# EAGLE design Group 13 Layout and sch v2 (EAGLE 9.2.0)
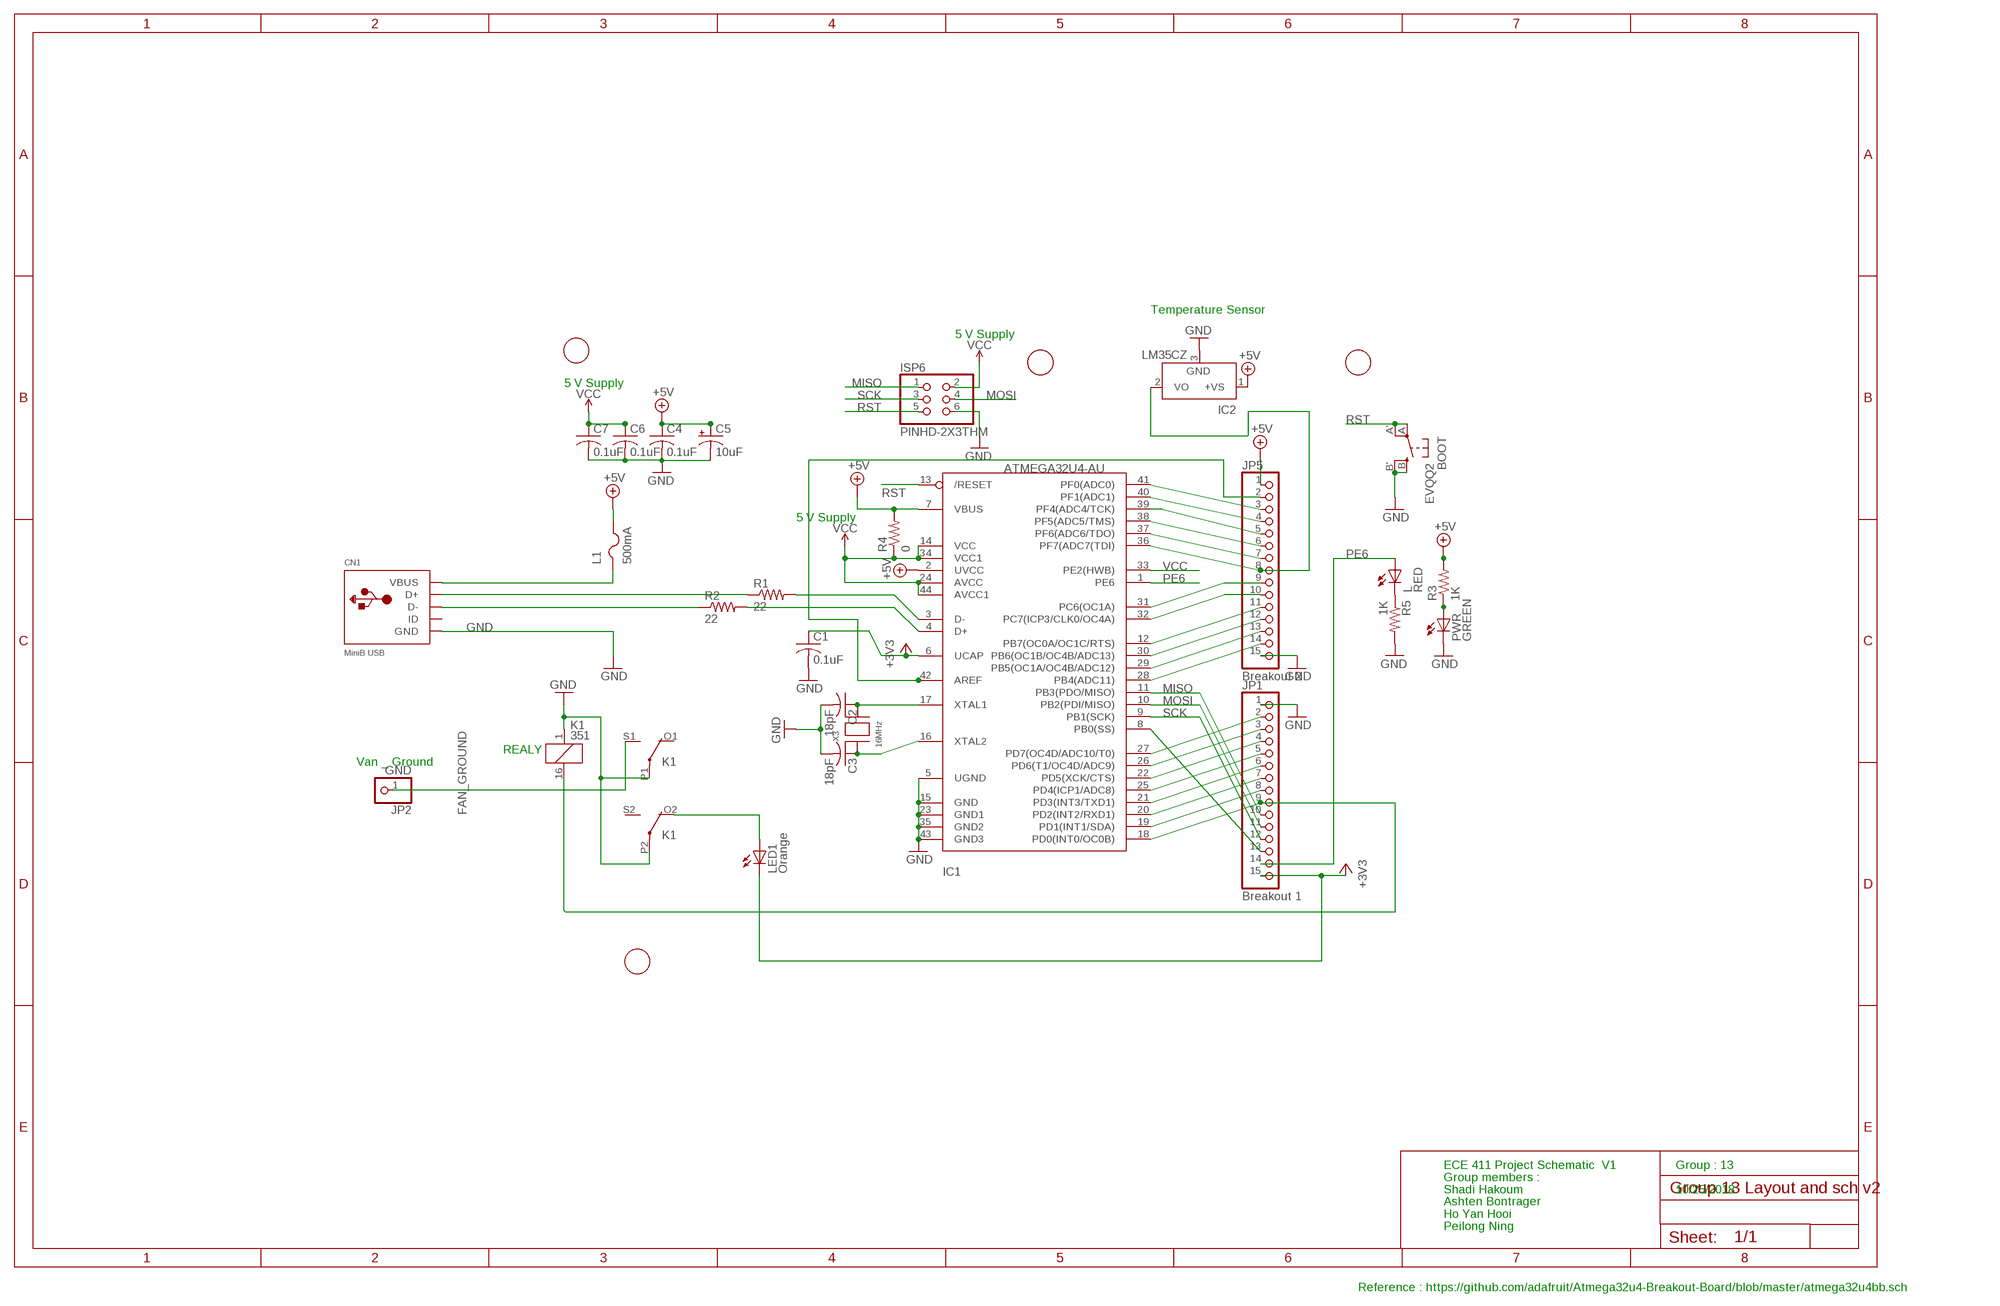
[diagram p0: schematic, sheet 1]

## Parts
BOOT  EVQQ2  [EVQ-Q2]
C1  0.1uF  C-USC0805K  [C0805K]
C2  18pF  C-USC0805K  [C0805K]
C3  18pF  C-USC0805K  [C0805K]
C4  0.1uF  C-USC0805K  [C0805K]
C5  10uF  CPOL-USA/3216-18R  [A/3216-18R]
C6  0.1uF  C-USC0805K  [C0805K]
C7  0.1uF  C-USC0805K  [C0805K]
CN1  MiniB USB  USBMINIB  [USB-MINIB]
IC1  ATMEGA32U4-AU  [TQFP44]
IC2  LM35CZ  [TO92]
ISP6  PINHD-2X3THM  [ISP6]
JP1  Breakout 1  PINHD-1X15-CB  [1X15-CB]
JP2  GND  PINHD-1X1  [1X01]
JP5  Breakout 2  PINHD-1X15-CB  [1X15-CB]
K1  351  [351]
L  RED  LEDCHIPLED_0805  [CHIPLED_0805]
L1  500mA  PTCFUSE-1206  [R1206]
LED1  Orange  LED3MM  [LED3MM]
PWR  GREEN  LEDCHIPLED_0805  [CHIPLED_0805]
R1  22  R-US_R0805  [R0805]
R2  22  R-US_R0805  [R0805]
R3  1K  R-US_R0805  [R0805]
R4  0  R-US_M1206  [M1206]
R5  1K  R-US_R0805  [R0805]
U$1  FIDUCIAL  [FIDUCIAL_1MM]
U$2  FIDUCIAL  [FIDUCIAL_1MM]
U$3  FIDUCIAL  [FIDUCIAL_1MM]
U$6  FIDUCIAL  [FIDUCIAL_1MM]
X3  16MHz  XTALNX5032  [NX5032]

## Nets
+3V3: C1.1 IC1.6(UCAP) JP1.15 LED1.K(C)
+5V: C4.1 C5.+ IC1.2(UVCC) IC1.7(VBUS) IC2.1(+VS) JP5.1 L1.2 R3.2 R4.2
FAN_GROUND: JP2.1 K1.S1(2:S)
GND: BOOT.B'(S1) BOOT.B(S) C1.2 C2.2 C3.2 C4.2 C5.- C6.2 C7.2 CN1.GND IC1.5(UGND) IC1.15(GND) IC1.23(GND1) IC1.35(GND2) IC1.43(GND3) IC2.3(GND) ISP6.6 JP1.1 JP5.15 K1.1 K1.P1(2:P) K1.P2(3:P) PWR.C R5.2
MISO: IC1.11(PB3(PDO/MISO)) ISP6.1 JP1.10
MOSI: IC1.10(PB2(PDI/MISO)) ISP6.4 JP1.11
N$1: PWR.A R3.1
N$2: CN1.D- R2.1
N$3: IC1.3(D-) R1.2
N$4: IC1.4(D+) R2.2
N$5: CN1.D+ R1.1
N$6: IC1.42(AREF) JP5.2
N$7: IC1.37(PF6(ADC6/TDO)) JP5.7
N$8: C2.1 IC1.17(XTAL1) X3.P$2
N$9: C3.1 IC1.16(XTAL2) X3.P$1
N$10: L.C R5.1
N$12: K1.O2(3:O) LED1.A
N$13: IC1.31(PC6(OC1A)) JP5.9
N$14: IC1.32(PC7(ICP3/CLK0/OC4A)) JP5.10
PB0: IC1.8(PB0(SS)) JP1.13
PB4: IC1.28(PB4(ADC11)) JP5.14
PB5: IC1.29(PB5(OC1A/OC4B/ADC12)) JP5.13
PB6: IC1.30(PB6(OC1B/OC4B/ADC13)) JP5.12
PB7: IC1.12(PB7(OC0A/OC1C/RTS)) JP5.11
PD0: IC1.18(PD0(INT0/OC0B)) JP1.9 K1.16
PD1: IC1.19(PD1(INT1/SDA)) JP1.8
PD2: IC1.20(PD2(INT2/RXD1)) JP1.7
PD3: IC1.21(PD3(INT3/TXD1)) JP1.6
PD4: IC1.25(PD4(ICP1/ADC8)) JP1.5
PD5: IC1.22(PD5(XCK/CTS)) JP1.4
PD6: IC1.26(PD6(T1/OC4D/ADC9)) JP1.3
PD7: IC1.27(PD7(OC4D/ADC10/T0)) JP1.2
PE6: IC1.1(PE6) JP1.14 L.A
PF0: IC1.41(PF0(ADC0)) JP5.3
PF1: IC1.40(PF1(ADC1)) JP5.4
PF4: IC1.39(PF4(ADC4/TCK)) JP5.5
PF5: IC1.38(PF5(ADC5/TMS)) JP5.6
PF7: IC1.36(PF7(ADC7(TDI)) IC2.2(VO) JP5.8
RST: BOOT.A'(P1) BOOT.A(P) IC1.13(/RESET) ISP6.5
SCK: IC1.9(PB1(SCK)) ISP6.3 JP1.12
VBUS: CN1.VBUS L1.1
VCC: C6.1 C7.1 IC1.14(VCC) IC1.24(AVCC) IC1.33(PE2(HWB)) IC1.34(VCC1) IC1.44(AVCC1) ISP6.2 R4.1
Unconnected: CN1.ID K1.O1(2:O) K1.S2(3:S)

## Notes on the sheet
- Temperature Sensor
- 5 V Supply
- 5 V Supply
- 5 V Supply
- REALY
- Van _ Ground
- ECE 411 Project Schematic  V1 | Group : 13
- Group members :
- Shadi Hakoum | 10/25/2018
- Ashten Bontrager
- Ho Yan Hooi
- Peilong Ning
- Reference : https://github.com/adafruit/Atmega32u4-Breakout-Board/blob/master/atmega32u4bb.sch

## Library data of the parts
BOOT = adaprog:EVQQ2
C1-C4 C6 C7 = adafruit:C-US: CAPACITOR, American symbol
C5 = adafruit:CPOL-US: POLARIZED CAPACITOR, American symbol
CN1 = adafruit:USB: USB Connectors USBMINIB - Surface Mount Female Mini-B USB Connector 4UConnector: 06564 By microbuilder.eu Thru-hole RA Female Mini-B USB Connector 4UConnector: 18732 By ladyada.net
IC1 = adaprog:ATMEGA32U4
IC2 = lm35:LM35: Single-Supply Centigrade Temperature Sensor Vout = (10mV/°C x Temp °C) +5mmmV Source: http://www.national.com/ds/LM/LM35.pdf
ISP6 = adaprog:PINHD-2X3
JP1 JP5 = adafruit:PINHD-1X15: PIN HEADER
JP2 = adafruit:PINHD-1X1: Pin header 1x1 for 0.1" spacing With round pins
K1 = relay:351: RELAY 2 x switch, Omron; OC_FARNELL: unknown; OC_NEWARK: unknown
L LED1 PWR = adafruit:LED: LED OSRAM: - CHIPLED LG R971, LG N971, LY N971, LG Q971, LY Q971, LO R971, LY R971 LH N974, LH R974 LS Q976, LO Q976, LY Q976 LO Q996 - Hyper CHIPLED LW Q18S LB Q993, LB Q99A, LB R99A - SideLED LS A670, LO A670, LY A670, LG A670, LP A670 LB A673, LV A673, LT A673, LW A673 LH A674 LY A675 LS A676, LA A676, LO A676, LY A676, LW A676 LS A679, LY A679, LG A679 - Hyper Micro SIDELED® LS Y876, LA Y876, LO Y876, LY Y876 LT Y87S - SmartLED LW L88C, LW L88S LB L89C, LB L89S, LG L890 LS L89K, LO L89K, LY L89K LS L896, LA L896, LO L896, LY L896 - TOPLED LS T670, LO T670, LY T670, LG T670, LP T670 LSG T670, LSP T670, LSY T670, LOP T670, LYG T670 LG T671, LOG T671, LSG T671 LB T673, LV T673, LT T673, LW T673 LH T674 LS T676, LA T676, LO T676, LY T676, LB T676, LH T676, LSB T676, LW T676 LB T67C, LV T67C, LT T67C, LS T67K, LO T67K, LY T67K, LW E67C LS E67B, LA E67B, LO E67B, LY E67B, LB E67C, LV E67C, LT E67C LW T67C LS T679, LY T679, LG T679 LS T770, LO T770, LY T770, LG T770, LP T770 LB T773, LV T773, LT T773, LW T773 LH T774 LS E675, LA E675, LY E675, LS T675 LS T776, LA T776, LO T776, LY T776, LB T776 LHGB T686 LT T68C, LB T68C - Hyper Mini TOPLED® LB M676 - Mini TOPLED Santana® LG M470 LS M47K, LO M47K, LY M47K Source: http://www.osram.convergy.de/
L1 = adafruit:PTCFUSE: PTC fuses, resettable thermistors
R1-R3 R5 = adafruit:R-US_: RESISTOR, American symbol
R4 = rcl:R-US_: RESISTOR, American symbol; SPICEPREFIX: R
U$1-U$3 U$6 = adafruit:FIDUCIAL: For use by pick and place machines to calibrate the vision/machine, 1mm By microbuilder.eu
X3 = adaprog:XTAL

## Board
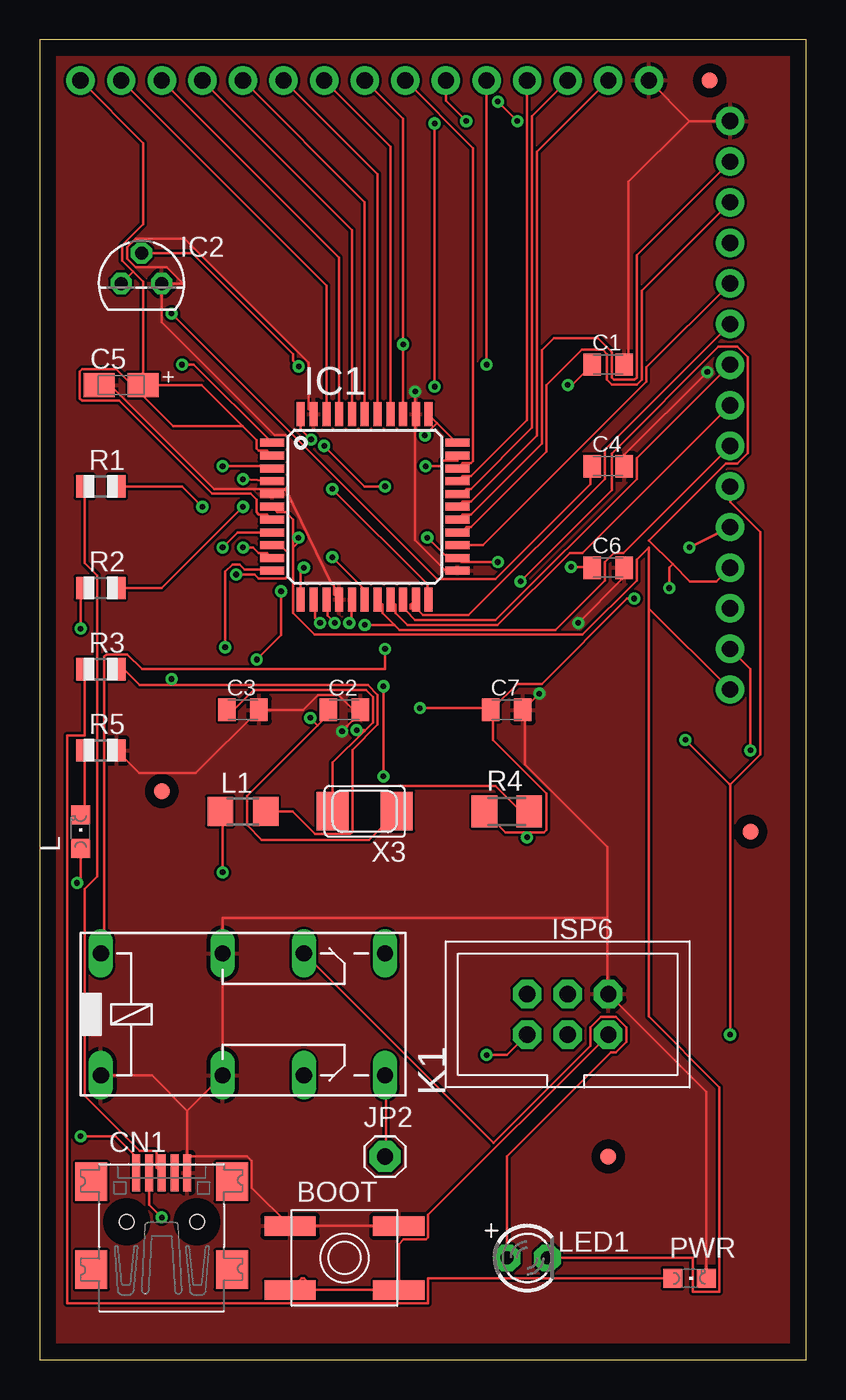
[diagram p1: board, top side]
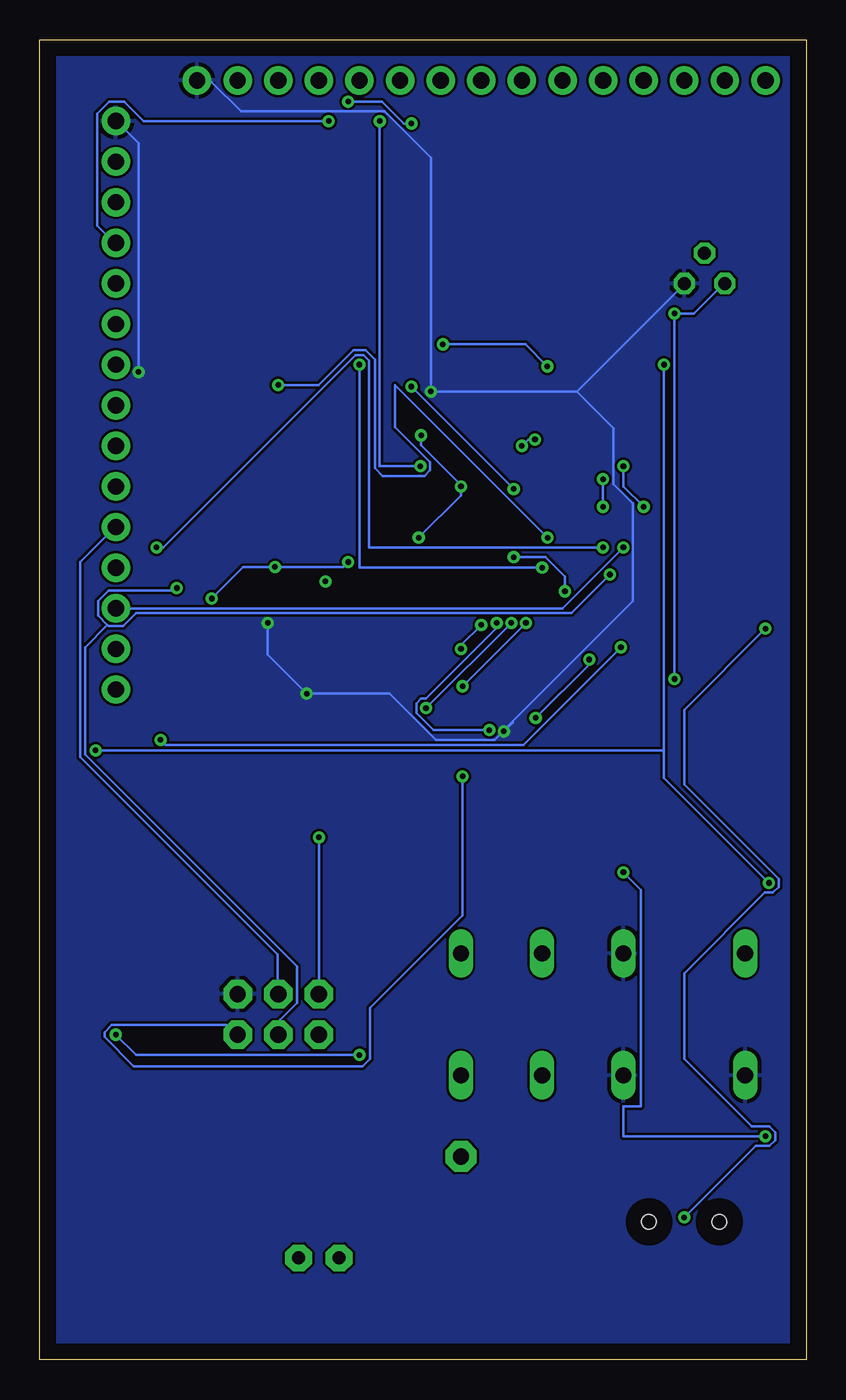
[diagram p2: board, bottom side, seen from below]

Size 47.93 x 82.54 mm. Coordinates in mm from the lower left corner, seen from the top.
Outline: 0,0 47.93,0 47.93,82.54 0,82.54 0,0
Copper layers (1*16): Top 0.035mm / dielectric 1.5mm / Bottom 0.035mm
Design rules "default": minimum track width 6mil, minimum drill 0.35mm, track to track 6mil, track to pad 6mil, pad to pad 6mil, via to via 6mil, smd to smd 6mil, copper to edge 40mil, drill to drill 6mil, minimum pad ring 10mil, minimum via ring 8mil, stop-mask expansion 4mil, vias tented up to drill 0mil, thermal gap 10mil

### Footprints (pad centres in the part's own frame; a part is rotated, then mirrored left to right if it is on the bottom)
EVQ-Q2 = smd 3.2 x 1.2: A -3.4,-2; A' 3.4,-2; B -3.4,2; B' 3.4,2
C0805K = smd 1.1 x 1.4: 1 -1,0; 2 1,0
A/3216-18R = smd 1.95 x 1.5: + 1.375,0; - -1.375,0
USB-MINIB = smd 0.5 x 2.308: D+ 0,4.064; D- -0.8,4.064; GND 1.6,4.064; ID 0.8,4.064; VBUS -1.6,4.064 | smd 2 x 2.4: GND1 -4.4,-2; GND2 -4.4,3.5; GND3 4.4,3.5; GND4 4.4,-2 | hole 0.9: -2.2,1; 2.2,1
TQFP44 = smd 1.5 x 0.5: 1 -5.8,4; 2 -5.8,3.2; 3 -5.8,2.4; 4 -5.8,1.6; 5 -5.8,0.8; 6 -5.8,0; 7 -5.8,-0.8; 8 -5.8,-1.6; 9 -5.8,-2.4; 10 -5.8,-3.2; 11 -5.8,-4; 23 5.8,-4; 24 5.8,-3.2; 25 5.8,-2.4; 26 5.8,-1.6; 27 5.8,-0.8; 28 5.8,0; 29 5.8,0.8; 30 5.8,1.6; 31 5.8,2.4; 32 5.8,3.2; 33 5.8,4 | smd 0.5 x 1.5: 12 -4,-5.8; 13 -3.2,-5.8; 14 -2.4,-5.8; 15 -1.6,-5.8; 16 -0.8,-5.8; 17 0,-5.8; 18 0.8,-5.8; 19 1.6,-5.8; 20 2.4,-5.8; 21 3.2,-5.8; 22 4,-5.8; 34 4,5.8; 35 3.2,5.8; 36 2.4,5.8; 37 1.6,5.8; 38 0.8,5.8; 39 0,5.8; 40 -0.8,5.8; 41 -1.6,5.8; 42 -2.4,5.8; 43 -3.2,5.8; 44 -4,5.8
TO92 = drill 0.813 octagon: 1 -1.27,0; 2 0,1.905; 3 1.27,0
ISP6 = drill 1.016 pad 1.778 octagon: 1 -2.54,-1.27; 2 -2.54,1.27; 3 0,-1.27; 4 0,1.27; 5 2.54,-1.27; 6 2.54,1.27
1X15-CB = drill 1.016 pad 1.778: 1 -17.78,0; 2 -15.24,0; 3 -12.7,0; 4 -10.16,0; 5 -7.62,0; 6 -5.08,0; 7 -2.54,0; 8 0,0; 9 2.54,0; 10 5.08,0; 11 7.62,0; 12 10.16,0; 13 12.7,0; 14 15.24,0; 15 17.78,0
1X01 = drill 1.016 pad 1.93 octagon: 1 0,0
351 = drill 1.016 long: 1 -3.81,-3.81; 16 -3.81,3.81; O1 8.89,-3.81; O2 8.89,3.81; P1 3.81,-3.81; P2 3.81,3.81; S1 13.97,-3.81; S2 13.97,3.81
CHIPLED_0805 = smd 1.2 x 1.2: A 0,-1.05; C 0,1.05
R1206 = smd 1.6 x 1.803: 1 -1.422,0; 2 1.422,0
LED3MM = drill 0.813 pad 1.676 octagon: A -1.27,0; K 1.27,0
R0805 = smd 1.1 x 1.4: 1 -1,0; 2 1,0
M1206 = smd 1.6 x 2: 1 -1.4,0; 2 1.4,0
FIDUCIAL_1MM = smd 1 x 1: 1 0,0
NX5032 = smd 2 x 2.4: P$1 2,0; P$2 -2,0

### Placement (x,y rotation side)
BOOT  19.05,6.35 0 top
C1  35.56,62.23 0 top
C2  19.05,40.64 0 top
C3  12.7,40.64 0 top
C4  35.56,55.88 0 top
C5  5.08,60.96 0 top
C6  35.56,49.53 0 top
C7  29.21,40.64 0 top
CN1  7.62,7.62 0 top
IC1  20.32,53.34 0 top
IC2  6.35,67.31 0 top
ISP6  33.02,21.59 0 top
JP1  43.18,59.69 270 top
JP2  21.59,12.7 0 top
JP5  20.32,80.01 0 top
K1  7.62,21.59 0 top
L  2.54,33.02 0 top
L1  12.7,34.29 0 top
LED1  30.48,6.35 0 top
PWR  40.64,5.08 270 top
R1  3.81,54.61 0 top
R2  3.81,48.26 0 top
R3  3.81,43.18 0 top
R4  29.21,34.29 0 top
R5  3.81,38.1 0 top
U$1  44.45,33.02 0 top
U$2  41.91,80.01 0 top
U$3  35.56,12.7 0 top
U$6  7.62,35.56 0 top
X3  20.32,34.29 180 top

### Tracks (layer width: path | path; a pad name or v marks a point on that pad's centre or on a via)
+3V3  (via drill 0.35)
  Top 0.152: 38.1,46.99 38.1,21.45 42.52,17.04 42.52,4.25 40.86,4.25 40.86,6.35 LED1.K | 38.1,46.99 38.1,50.8 37.34,50.04 37.34,48.74 33.95,45.34 17.2,45.34 15.84,46.7 15.84,50.8 | 38.1,46.99 JP1.15 | IC1.6 14.84,53.02 15.37,53.02 15.84,52.54 15.84,50.8 | C1.1 33.29,60.96 v33.02,60.96 | v16.17,51.41 16.17,51.13 15.84,50.8
  Bottom 0.152: v16.17,51.41 25.72,60.96 25.72,58.33 23.52,56.13 23.52,55.63 23.88,55.27 26.49,55.27 26.98,55.75 26.98,62.55 27.56,63.14 28.32,63.14 30.5,60.96 v33.02,60.96
+5V  (via drill 0.35)
  Top 0.152: 12.67,58.39 10.1,60.96 C5.+ 6.46,67.42 5.82,68.05 | 12.67,58.39 13.54,57.52 13.54,57 13.68,56.86 14.2,56.86 IC1.2 | JP5.1 6.46,76.09 6.46,71.01 5.16,69.71 5.16,68.72 5.82,68.05 | R3.2 5.23,43.18 6.23,42.18 8.23,42.18 | 19.55,35.87 19.55,33 19.41,32.86 17.23,32.86 15.8,34.29 L1.2 | 19.55,35.87 19.55,38.13 21.13,39.72 21.13,41.56 20.52,42.18 8.23,42.18 | IC1.7 14.2,52.86 13.68,52.86 13.54,53 13.54,53.8 13.18,54.16 10.78,54.16 4.95,59.98 2.63,59.98 2.5,60.12 2.5,61.8 2.63,61.94 4.78,61.94 8.32,58.39 12.67,58.39 | 19.55,35.87 28.5,35.87 30.02,34.34 30.48,34.34 R4.2 | v8.23,65.43 24.84,48.82 28.5,48.82 34.44,54.76 34.44,55.83 C4.1 | v8.23,42.57 8.23,42.18 | IC2.1 5.82,68.05
  Bottom 0.152: IC2.1 5.18,67.26 7.01,65.43 v8.23,65.43 v8.23,42.57
FAN_GROUND
  Top 0.152: K1.S1 21.64,17.73 21.64,12.7 JP2.1
GND  (via drill 0.35)
  Top 0.152: JP5.15 40.64,77.47 | 40.64,77.47 JP1.1 | 40.64,77.47 36.83,73.66 36.83,62.23 C1.2 | IC1.43 16.8,59.46 16.8,62.37 9.07,70.1 5.98,70.1 5.46,69.58 5.46,68.85 5.98,68.33 7.93,68.33 8.95,67.31 IC2.3 7.62,64.88 14.68,57.82 15.37,57.82 15.5,57.69 15.5,54.6 15.37,54.46 | C5.- 4.41,60.96 10.9,54.46 15.37,54.46 | CN1.GND 9.22,12.7 | 9.22,12.7 9.22,15.57 | 9.22,15.57 K1.P1 K1.P2 11.43,27.63 35.51,27.63 | 9.22,12.7 12.96,12.7 13.25,12.41 13.25,10.75 BOOT.B BOOT.B' | PWR.C 41.69,16.73 ISP6.6 35.51,22.91 35.51,27.63 | 9.22,15.57 7.01,17.78 K1.1 | R5.2 6.21,36.7 7.47,36.7 7.48,36.7 7.76,36.7 7.77,36.7 9.76,36.7 C3.2 16.48,40.64 17.41,41.57 18.7,41.57 19.62,40.64 | 19.62,40.64 C2.2 | 15.37,54.46 IC1.5 | 15.37,54.46 18.25,48.52 18.27,48.52 18.4,48.39 18.4,47.86 IC1.15 | 35.51,27.63 35.51,32.05 30.33,37.24 30.33,40.59 C7.2 30.33,40.74 v31.24,41.66 | v33.68,46.08 36.42,48.82 36.42,49.43 C6.2 | v41.76,61.77 36.58,56.59 36.58,55.98 C4.2 | IC1.23 26.06,49.43 25.3,49.43 23.47,51.26 23.47,59.03 IC1.35 23.47,59.18 v23.47,60.55 | 19.62,40.64 19.62,40.01 19.59,39.98 19.56,39.98 19.2,39.62 19.2,39.6 v18.9,39.29
  Bottom 0.152: v33.68,46.08 33.68,44.09 v31.24,41.66 26.06,41.66 23.16,38.76 19.51,38.76 18.34,39.93 | v41.76,61.77 41.76,76.1 43.13,77.47 JP1.1 | 14.33,60.55 v23.47,60.55 23.47,75.18 26.36,78.08 35.36,78.08 37.19,79.91 38.1,79.91 JP5.15 | 14.33,60.55 7.62,67.26 IC2.3 | 18.34,39.93 10.82,47.45 10.82,53.54 12.04,54.76 12.04,58.27 14.33,60.55 | v18.9,39.29 18.34,39.86 18.34,39.93
  pour Top: -1.27,83.82 -1.27,-1.27 49.53,-1.27 49.53,83.82
  pour Bottom: -2.54,85.09 50.8,85.09 50.8,-2.54 -2.54,-2.54
MISO  (via drill 0.35)
  Top 0.152: JP1.10 43.18,53.65 45.06,51.77 45.06,37.85 43.18,35.97 | 43.18,35.97 v43.18,20.32 | v27.94,19.05 29.21,19.05 ISP6.1 | v11.58,44.55 11.58,49.28 12.04,49.73 12.5,49.73 12.8,49.43 14.48,49.43 IC1.11 | v40.39,38.76 43.13,36.02 43.18,35.97
  Bottom 0.152: v43.18,20.32 41.91,19.05 v27.94,19.05 | v11.58,44.55 17.68,38.46 40.08,38.46 v40.39,38.76
MOSI  (via drill 0.35)
  Top 0.152: JP1.11 v40.64,50.8 | IC1.10 14.2,50.46 13.68,50.46 13.34,50.8 v12.7,50.8
  Bottom 0.152: v40.64,50.8 40.23,50.8 28.19,62.84 27.69,62.84 27.33,62.48 27.33,50.8 v12.7,50.8 | ISP6.4 33.07,22.91 33.07,25.35 45.41,37.69 45.41,49.89 43.28,52.02 JP1.11
N$1
  Top 0.152: PWR.A 24.28,5.08 24.28,3.52 1.71,3.52 1.71,39.03 2.81,39.03 R3.1
N$2  (via drill 0.35)
  Top 0.152: CN1.D- 6.82,9.69 v7.62,8.89 | v2.54,45.72 2.54,47.99 R2.1
  Bottom 0.152: v2.54,45.72 7.62,40.64 7.62,35.97 1.71,30.06 1.71,29.56 2.07,29.21 2.57,29.21 7.62,24.16 7.62,18.8 3.4,14.58 2.29,14.58 1.93,14.22 1.93,13.72 2.29,13.36 3.15,13.36 v7.62,8.89
N$3  (via drill 0.35)
  Top 0.152: R1.2 8.89,54.61 v10.16,53.34 | v11.43,55.88 14.38,55.88 IC1.3
  Bottom 0.152: v10.16,53.34 11.43,54.61 v11.43,55.88
N$4  (via drill 0.35)
  Top 0.152: R2.2 7.62,48.26 v12.7,53.34 | v12.7,55.07 IC1.4
  Bottom 0.152: v12.7,53.34 v12.7,55.07
N$5
  Top 0.152: CN1.D+ 7.3,12 7.3,12.93 7.17,13.07 6.24,13.07 2.81,16.49 2.81,29.45 3.59,30.22 3.59,49.05 2.81,49.83 R1.1
N$6
  Top 0.152: JP5.2 17.92,67.17 IC1.42
N$7
  Top 0.152: JP5.7 21.92,75.87 IC1.37
N$8  (via drill 0.35)
  Top 0.152: 17.37,39.68 12.95,35.26 12.95,33.43 13.87,32.51 20.57,32.51 22.25,34.19 X3.P$2 | 17.37,39.68 17.98,40.28 17.98,40.59 C2.1 | v18.29,50.19 20.27,48.21 20.27,47.6 IC1.17 | v15.09,48.06 15.09,45.31 v13.56,43.79 | 17.37,39.68 v16.92,40.13
  Bottom 0.152: v18.29,50.19 16.31,50.19 15.09,48.97 v15.09,48.06 | v13.56,43.79 13.56,43.49 v16.92,40.13
N$9  (via drill 0.35)
  Top 0.152: X3.P$1 18.32,37.34 20.31,39.33 | 20.31,39.33 20.83,39.85 20.83,41.44 20.39,41.87 13.36,41.87 12.13,40.64 C3.1 | v19.36,46.08 19.51,46.23 19.51,47.45 IC1.16 | v19.81,39.37 20.27,39.37 20.31,39.33
  Bottom 0.152: v19.36,46.08 19.36,45.77 23.77,41.35 24.08,41.35 24.38,41.05 24.38,40.44 23.32,39.37 v19.81,39.37
N$10
  Top 0.152: L.C 2.81,34.34 R5.1
N$12
  Top 0.152: LED1.A 29.21,12.7 35.71,19.2 36.02,19.2 36.68,19.86 36.68,20.78 36.02,21.44 35.1,21.44 34.44,20.78 34.44,19.63 28.36,13.55 K1.O2
N$13
  Top 0.152: IC1.31 26.44,56.06 26.96,56.06 27.1,56.2 27.1,75.77 JP5.9
N$14  (via drill 0.35)
  Top 0.152: JP5.10 25.4,78.74 v26.67,77.47 | v24.13,55.88 25.14,55.88 25.14,56.22 26.12,56.22 IC1.32
  Bottom 0.152: v26.67,77.47 26.67,55.88 v24.13,55.88
PB0  (via drill 0.35)
  Top 0.152: v11.43,50.8 12.37,51.74 IC1.8
  Bottom 0.152: JP1.13 15.24,46.99 v11.43,50.8
PB4
  Top 0.152: JP5.14 31.09,75.54 31.09,57.79 26.96,53.66 26.44,53.66 IC1.28
PB5
  Top 0.152: JP5.13 30.79,77.77 30.79,58.28 26.96,54.46 26.67,54.46 26.35,54.14 IC1.29
PB6
  Top 0.152: IC1.30 26.44,55.26 26.96,55.26 30.48,58.78 JP5.12
PB7  (via drill 0.35)
  Top 0.152: JP5.11 v27.94,62.23 | v16.51,49.53 16.32,49.53 IC1.12
  Bottom 0.152: v27.94,62.23 27.94,49.53 v16.51,49.53
PD0  (via drill 0.35)
  Top 0.152: JP1.9 36.49,50.46 35.91,50.46 35.34,49.88 35.34,48.74 32.25,45.65 22.49,45.65 22.19,45.95 | IC1.18 21.44,47.22 21.44,46.7 22.19,45.95 | v21.59,44.45 21.59,43.18 6.38,43.18 5.46,44.11 4.17,44.11 4.03,43.98 4.03,25.62 K1.16 | v20.32,45.95 22.19,45.95
  Bottom 0.152: v21.59,44.45 21.59,44.68 v20.32,45.95
PD1
  Top 0.152: JP1.8 33.95,50.46 33.14,50.46 28.64,45.95 22.98,45.95 22.24,46.7 22.24,47.22 IC1.19
PD2
  Top 0.152: JP1.7 37.34,56.39 37.34,55.09 28.51,46.26 23.48,46.26 22.89,46.84 22.89,47.37 IC1.20
PD3
  Top 0.152: JP1.6 35.34,56.93 35.34,55.09 26.82,46.56 23.98,46.56 23.55,46.99 23.2,46.99 23.2,47.22 IC1.21
PD4
  Top 0.152: JP1.5 37.95,62.08 37.95,61.18 27.7,50.94 IC1.25
PD5  (via drill 0.35)
  Top 0.152: v18.29,54.46 24.23,48.51 24.23,47.6 IC1.22 | v24.69,77.32 v24.69,60.86 | v29.87,77.47 v28.65,78.69
  Bottom 0.152: v24.69,60.86 v18.29,54.46 | v24.69,77.32 25.15,77.32 26.52,78.69 v28.65,78.69 | v29.87,77.47 41.45,77.47 42.67,78.69 43.59,78.69 44.35,77.93 44.35,70.92 43.28,69.85 JP1.4
PD6
  Top 0.152: JP1.3 37.64,66.85 37.64,61.31 37.33,61 35.79,61 35.48,61.31 35.48,62.9 35.22,63.16 33.91,63.16 31.7,60.94 31.7,56.8 26.96,52.06 26.67,52.06 26.35,51.74 IC1.26
PD7
  Top 0.152: IC1.27 26.44,52.86 26.96,52.86 31.39,57.29 31.39,63.14 32.15,63.9 34.9,63.9 35.78,63.03 35.78,61.44 35.91,61.3 37.2,61.3 37.34,61.44 37.34,69.09 JP1.2
PE6  (via drill 0.35)
  Top 0.152: IC1.1 9.63,62.23 v8.89,62.23 | v2.32,29.81 2.54,30.04 L.A | JP1.14 44.45,43.18 v44.45,38.1
  Bottom 0.152: v8.89,62.23 8.89,38.1 | 8.89,38.1 8.89,36.39 v2.32,29.81 | v44.45,38.1 8.89,38.1
PF0
  Top 0.152: JP5.3 18.72,68.91 IC1.41
PF1
  Top 0.152: JP5.4 19.52,70.65 IC1.40
PF4
  Top 0.152: JP5.5 20.32,72.39 IC1.39
PF5
  Top 0.152: JP5.6 21.12,74.13 IC1.38
PF7  (via drill 0.35)
  Top 0.152: JP5.8 22.72,77.61 v22.72,63.5 IC1.36 | IC2.2 9.53,69.21 15.84,62.9 15.84,62.47 v16.19,62.12
  Bottom 0.152: v16.19,62.12 17.57,63.5 v22.72,63.5
RST  (via drill 0.35)
  Top 0.152: BOOT.A 16.38,5.08 16.51,5.08 17.24,4.35 BOOT.A' 22.45,7.21 22.76,7.52 24.14,7.52 24.28,7.65 24.28,9.04 ISP6.5 | v17.53,46.08 17.22,46.38 17.22,47.45 IC1.13 | v21.49,36.47 v21.49,42.11
  Bottom 0.152: v21.49,42.11 v17.53,46.08 | v21.49,36.47 21.49,27.79 27.28,22 27.28,18.8 27.74,18.34 42.06,18.34 43.89,20.17 43.89,20.47 43.43,20.93 36.27,20.93 35.66,20.32 ISP6.5
SCK  (via drill 0.35)
  Top 0.152: JP1.12 42.32,48.67 40.66,48.67 39.59,49.75 | v30.07,48.67 35.78,54.39 35.78,56.68 42.45,63.35 43.64,63.35 44.3,62.69 44.3,56.69 43.64,56.03 42.9,56.03 38.1,51.23 39.59,49.75 | IC1.9 14.11,50.94 14.28,50.77 15.22,50.77 15.5,50.49 15.5,49 15.37,48.86 13.68,48.86 13.44,49.1 v12.27,49.1 | v39.37,48.26 39.37,49.53 39.59,49.75
  Bottom 0.152: 43.72,45.95 43.64,45.87 42.72,45.87 41.9,46.69 14.69,46.69 v12.27,49.1 | 43.72,45.95 44.3,46.53 44.3,47.45 43.64,48.11 39.52,48.11 v39.37,48.26 | 43.72,45.95 45.11,44.55 45.11,37.85 31.85,24.59 31.85,22.3 32.92,21.23 32.92,20.32 ISP6.3
VBUS  (via drill 0.35)
  Top 0.152: CN1.VBUS 6.02,12.76 5.93,12.76 4.72,13.97 v2.54,13.97 | v11.43,30.48 11.43,34.29 L1.1
  Bottom 0.152: v2.54,13.97 11.43,13.97 11.43,15.82 10.34,15.82 10.34,29.39 v11.43,30.48
VCC  (via drill 0.35)
  Top 0.152: 24.84,58.57 24.38,59.03 IC1.34 | 24.84,58.57 26.06,57.35 IC1.33 | v33.22,49.58 34.44,49.58 C6.1 | v28.65,49.89 26.36,49.89 26.21,50.04 IC1.24 26.06,50.19 25.45,50.19 v24.23,51.41 | v24.08,57.81 24.84,58.57 | 30.48,32.97 29.11,32.97 27.89,34.19 R4.1 | 30.48,32.97 31.55,32.97 31.7,33.12 31.7,35.41 28.35,38.76 28.35,40.59 C7.1 | v18.44,46.08 17.98,46.53 17.98,47.45 IC1.14 | v23.77,40.74 28.19,40.74 C7.1 | 30.48,32.97 v30.48,32.66 | v37.19,47.6 36.73,47.6 31.39,42.27 29.87,42.27 28.35,40.74 C7.1 | v21.59,54.61 20.32,54.61 v17.78,57.15 | v16.96,57.55 16.32,58.2 IC1.44
  Bottom 0.152: v28.65,49.89 28.96,49.58 v33.22,49.58 35.2,49.58 v37.19,47.6 | v23.77,40.74 v18.44,46.08 | v30.48,32.66 ISP6.2 | v17.78,57.15 17.38,57.55 v16.96,57.55 | v24.23,51.41 21.59,54.05 v21.59,54.61 21.59,54.71 24.08,57.2 v24.08,57.81